# Altium schematic sheet ADC.SchDoc (part 1 of 3)
size Letter; DrawnBy: Titan Yuan; DocumentNumber: 4; SheetNumber: 4; SheetTotal: 7
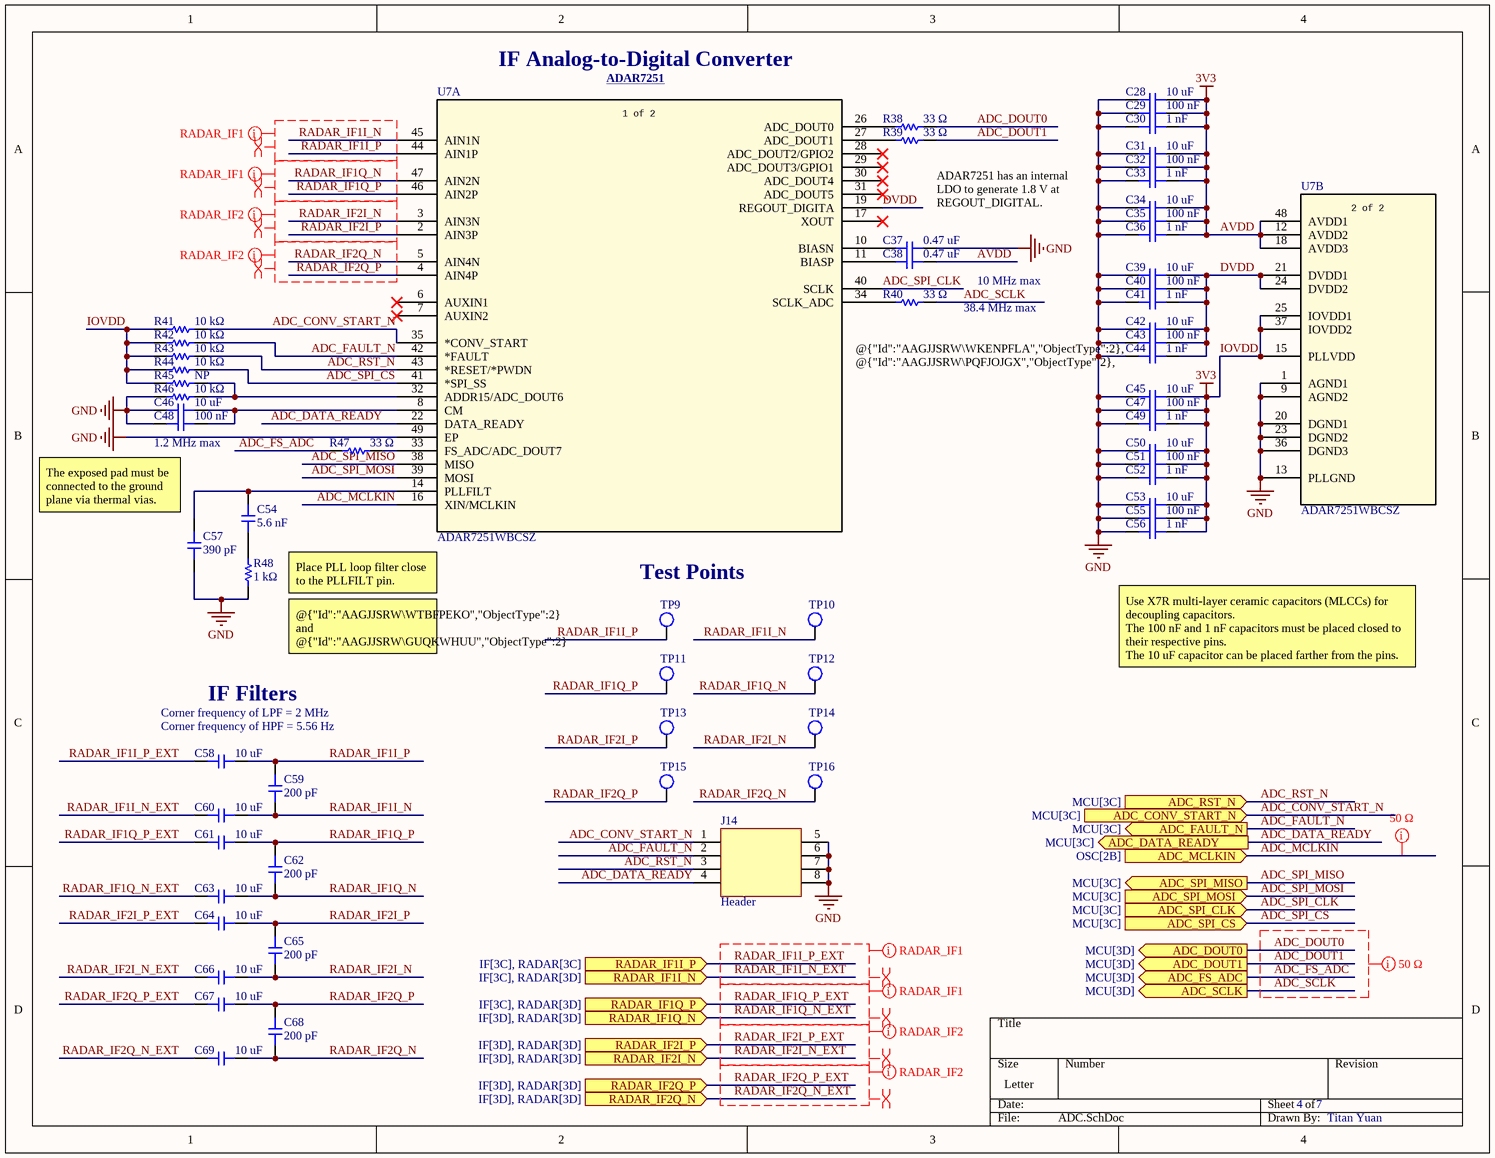
[diagram p0: ADC.SchDoc]

## Parts
C28  10 uF  [CAP_0805]
C29  100 nF  [CAP_0402]
C30  1 nF  [CAP_0402]
C31  10 uF  [CAP_0805]
C32  100 nF  [CAP_0402]
C33  1 nF  [CAP_0402]
C34  10 uF  [CAP_0805]
C35  100 nF  [CAP_0402]
C36  1 nF  [CAP_0402]
C37  0.47 uF  [CAP_0402]
C38  0.47 uF  [CAP_0402]
C39  10 uF  [CAP_0805]
C40  100 nF  [CAP_0402]
C41  1 nF  [CAP_0402]
C42  10 uF  [CAP_0805]
C43  100 nF  [CAP_0402]
C44  1 nF  [CAP_0402]
C45  10 uF  [CAP_0805]
C46  10 uF  [CAP_0805]
C47  100 nF  [CAP_0402]
C48  100 nF  [CAP_0402]
C49  1 nF  [CAP_0402]
C50  10 uF  [CAP_0805]
C51  100 nF  [CAP_0402]
C52  1 nF  [CAP_0402]
C53  10 uF  [CAP_0805]
C54  5.6 nF  [CAP_0402]
C55  100 nF  [CAP_0402]
C56  1 nF  [CAP_0402]
C57  390 pF  [CAP_0402]
C58  10 uF  [CAP_0805]
C59  200 pF  [CAP_0603]
C60  10 uF  [CAP_0805]
C61  10 uF  [CAP_0805]
C62  200 pF  [CAP_0603]
C63  10 uF  [CAP_0805]
C64  10 uF  [CAP_0805]
C65  200 pF  [CAP_0603]
C66  10 uF  [CAP_0805]
C67  10 uF  [CAP_0805]
C68  200 pF  [CAP_0603]
C69  10 uF  [CAP_0805]
J14  Header  [CONN_2x4_2.54mm_PinHeader_Vertical]
R38  33 Ω  [RES_0402]
R39  33 Ω  [RES_0402]
R40  33 Ω  [RES_0402]
R41  10 kΩ  [RES_0402]
R42  10 kΩ  [RES_0402]
R43  10 kΩ  [RES_0402]
R44  10 kΩ  [RES_0402]
R45  NP  [RES_0402]
R46  10 kΩ  [RES_0402]
R47  33 Ω  [RES_0402]
R48  1 kΩ  [RES_0402]
TP9  TEST_POINT  [TEST_POINT]  (value not drawn)
TP10  TEST_POINT  [TEST_POINT]  (value not drawn)
TP11  TEST_POINT  [TEST_POINT]  (value not drawn)
TP12  TEST_POINT  [TEST_POINT]  (value not drawn)
TP13  TEST_POINT  [TEST_POINT]  (value not drawn)
TP14  TEST_POINT  [TEST_POINT]  (value not drawn)
TP15  TEST_POINT  [TEST_POINT]  (value not drawn)
TP16  TEST_POINT  [TEST_POINT]  (value not drawn)
U7  ADAR7251WBCSZ  [CS_48_1_ADI]  (parts A,B of 2)

## Ports
ADC_CONV_START_N (in, see MCU[3C]), ADC_DATA_READY (out, see MCU[3C]), ADC_DOUT0 (out, see MCU[3D]), ADC_DOUT1 (out, see MCU[3D]), ADC_FAULT_N (out, see MCU[3C]), ADC_FS_ADC (out, see MCU[3D]), ADC_MCLKIN (in, see OSC[2B]), ADC_RST_N (in, see MCU[3C]), ADC_SCLK (out, see MCU[3D]), ADC_SPI_CLK (in, see MCU[3C]), ADC_SPI_CS (in, see MCU[3C]), ADC_SPI_MISO (out, see MCU[3C]), ADC_SPI_MOSI (in, see MCU[3C]), RADAR_IF1I_N (in, see IF[3C], RADAR[3D]), RADAR_IF1I_P (in, see IF[3C], RADAR[3C]), RADAR_IF1Q_N (in, see IF[3D], RADAR[3D]), RADAR_IF1Q_P (in, see IF[3C], RADAR[3D]), RADAR_IF2I_N (in, see IF[3D], RADAR[3D]), RADAR_IF2I_P (in, see IF[3D], RADAR[3D]), RADAR_IF2Q_N (in, see IF[3D], RADAR[3D]), RADAR_IF2Q_P (in, see IF[3D], RADAR[3D])

## Nets
AVDD: C28.2 C29.2 C30.2 C31.2 C32.2 C33.2 C34.2 C35.2 C36.2 C38.1 C45.2 C47.2 C49.2 C50.2 C51.2 C52.2 C53.2 C55.2 C56.2 R41.2 R42.2 R43.2 R44.2 R45.2 U7.12(AVDD2) U7.15(PLLVDD) U7.18(AVDD3) U7.25(IOVDD1) U7.37(IOVDD2) U7.48(AVDD1)  [also labelled 3V3, IOVDD]
GND: C28.1 C29.1 C30.1 C31.1 C32.1 C33.1 C34.1 C35.1 C36.1 C37.1 C39.1 C40.1 C41.1 C42.1 C43.1 C44.1 C45.1 C46.1 C47.1 C48.1 C49.1 C50.1 C51.1 C52.1 C53.1 C55.1 C56.1 C57.1 J14.5 J14.6 J14.7 J14.8 R46.2 R48.1 U7.1(AGND1) U7.9(AGND2) U7.13(PLLGND) U7.20(DGND1) U7.23(DGND2) U7.36(DGND3) U7.49(EP)
ADC_CONV_START_N: J14.1 R41.1 U7.35(*CONV_START) ; port ADC_CONV_START_N
ADC_DATA_READY: J14.4 U7.22(DATA_READY) ; port ADC_DATA_READY
ADC_DOUT0: R38.2 ; port ADC_DOUT0
ADC_DOUT1: R39.2 ; port ADC_DOUT1
ADC_FAULT_N: J14.2 R42.1 U7.42(*FAULT) ; port ADC_FAULT_N
ADC_FS_ADC: R47.1 ; port ADC_FS_ADC
ADC_MCLKIN: U7.16(XIN/MCLKIN) ; port ADC_MCLKIN
ADC_RST_N: J14.3 R43.1 U7.43(*RESET/*PWDN) ; port ADC_RST_N
ADC_SCLK: R40.2 ; port ADC_SCLK
ADC_SPI_CLK: U7.40(SCLK) ; port ADC_SPI_CLK
ADC_SPI_CS: R44.1 U7.41(*SPI_SS) ; port ADC_SPI_CS
ADC_SPI_MISO: U7.38(MISO) ; port ADC_SPI_MISO
ADC_SPI_MOSI: U7.39(MOSI) ; port ADC_SPI_MOSI
DVDD: C39.2 C40.2 C41.2 C42.2 C43.2 C44.2 U7.19(REGOUT_DIGITA) U7.21(DVDD1) U7.24(DVDD2)
RADAR_IF1I_N: C59.1 C60.2 TP10.1 U7.45(AIN1N)
RADAR_IF1I_N_EXT: C60.1 ; port RADAR_IF1I_N
RADAR_IF1I_P: C58.2 C59.2 TP9.1 U7.44(AIN1P)
RADAR_IF1I_P_EXT: C58.1 ; port RADAR_IF1I_P
RADAR_IF1Q_N: C62.1 C63.2 TP12.1 U7.47(AIN2N)
RADAR_IF1Q_N_EXT: C63.1 ; port RADAR_IF1Q_N
RADAR_IF1Q_P: C61.2 C62.2 TP11.1 U7.46(AIN2P)
RADAR_IF1Q_P_EXT: C61.1 ; port RADAR_IF1Q_P
RADAR_IF2I_N: C65.1 C66.2 TP14.1 U7.3(AIN3N)
RADAR_IF2I_N_EXT: C66.1 ; port RADAR_IF2I_N
RADAR_IF2I_P: C64.2 C65.2 TP13.1 U7.2(AIN3P)
RADAR_IF2I_P_EXT: C64.1 ; port RADAR_IF2I_P
RADAR_IF2Q_N: C68.1 C69.2 TP16.1 U7.5(AIN4N)
RADAR_IF2Q_N_EXT: C69.1 ; port RADAR_IF2Q_N
RADAR_IF2Q_P: C67.2 C68.2 TP15.1 U7.4(AIN4P)
RADAR_IF2Q_P_EXT: C67.1 ; port RADAR_IF2Q_P
NetC37_2: C37.2 U7.10(BIASN)
NetC38_2: C38.2 U7.11(BIASP)
NetC46_2: C46.2 C48.2 U7.8(CM)
NetC54_1: C54.1 R48.2
NetC54_2: C54.2 C57.2 U7.14(PLLFILT)
NetR38_1: R38.1 U7.26(ADC_DOUT0)
NetR39_1: R39.1 U7.27(ADC_DOUT1)
NetR40_1: R40.1 U7.34(SCLK_ADC)
NetR45_1: R45.1 R46.1 U7.32(ADDR15/ADC_DOUT6)
NetR47_2: R47.2 U7.33(FS_ADC/ADC_DOUT7)

Not connected (* = marked no-connect by the designer): U7 6(AUXIN1)* 7(AUXIN2)* 17(XOUT)* 28(ADC_DOUT2/GPIO2)* 29(ADC_DOUT3/GPIO1)* 30(ADC_DOUT4)* 31(ADC_DOUT5)*

## Layout directives
net class 50 Ω: ADC_DOUT0, ADC_DOUT1, ADC_FS_ADC, ADC_MCLKIN, ADC_SCLK
differential pair: RADAR_IF1I_N, RADAR_IF1I_N_EXT, RADAR_IF1I_P, RADAR_IF1I_P_EXT, RADAR_IF1Q_N, RADAR_IF1Q_N_EXT, RADAR_IF1Q_P, RADAR_IF1Q_P_EXT, RADAR_IF2I_N, RADAR_IF2I_N_EXT, RADAR_IF2I_P, RADAR_IF2I_P_EXT, RADAR_IF2Q_N, RADAR_IF2Q_N_EXT, RADAR_IF2Q_P, RADAR_IF2Q_P_EXT
mark named RADAR_IF1: RADAR_IF1I_N, RADAR_IF1I_N_EXT, RADAR_IF1I_P, RADAR_IF1I_P_EXT, RADAR_IF1Q_N, RADAR_IF1Q_N_EXT, RADAR_IF1Q_P, RADAR_IF1Q_P_EXT
mark named RADAR_IF2: RADAR_IF2I_N, RADAR_IF2I_N_EXT, RADAR_IF2I_P, RADAR_IF2I_P_EXT, RADAR_IF2Q_N, RADAR_IF2Q_N_EXT, RADAR_IF2Q_P, RADAR_IF2Q_P_EXT

## Notes on the sheet
- IF Analog-to-Digital Converter
- (near U7) ADAR7251 <https://www.analog.com/en/products/adar7251.html>
- ADAR7251 has an internal LDO to generate 1.8 V at REGOUT_DIGITAL.
- 10 MHz max
- (near U7) @{"Id":"AAGJJSRW\WKENPFLA","ObjectType":2}, @{"Id":"AAGJJSRW\PQFJOJGX","ObjectType":2}, @{"Id":"AAGJJSRW\MFIUAKVZ","ObjectType":2}, and @{"Id":"AAGJJSRW\DOLTHUHP","ObjectType":2} serve to damp the fast edges of the digital signals.
- 38.4 MHz max
- The exposed pad must be connected to the ground plane via thermal vias.
- (near C48) 1.2 MHz max
- Place PLL loop filter close to the PLLFILT pin.
- Test Points
- IF Filters
- (near R48) @{"Id":"AAGJJSRW\WTBFPEKO","ObjectType":2} and @{"Id":"AAGJJSRW\GUQKWHUU","ObjectType":2} must be NPO type for best temperature performance.
- Use X7R multi-layer ceramic capacitors (MLCCs) for decoupling capacitors.
  The 100 nF and 1 nF capacitors must be placed closed to their respective pins.
  The 10 uF capacitor can be placed farther from the pins.
- Corner frequency of LPF = 2 MHz
- Corner frequency of HPF = 5.56 Hz
- (in symbol ADAR7251WBCSZ, part A) 1 of 2
- (in symbol ADAR7251WBCSZ, part B) 2 of 2